# Altium project H.PrjPCB
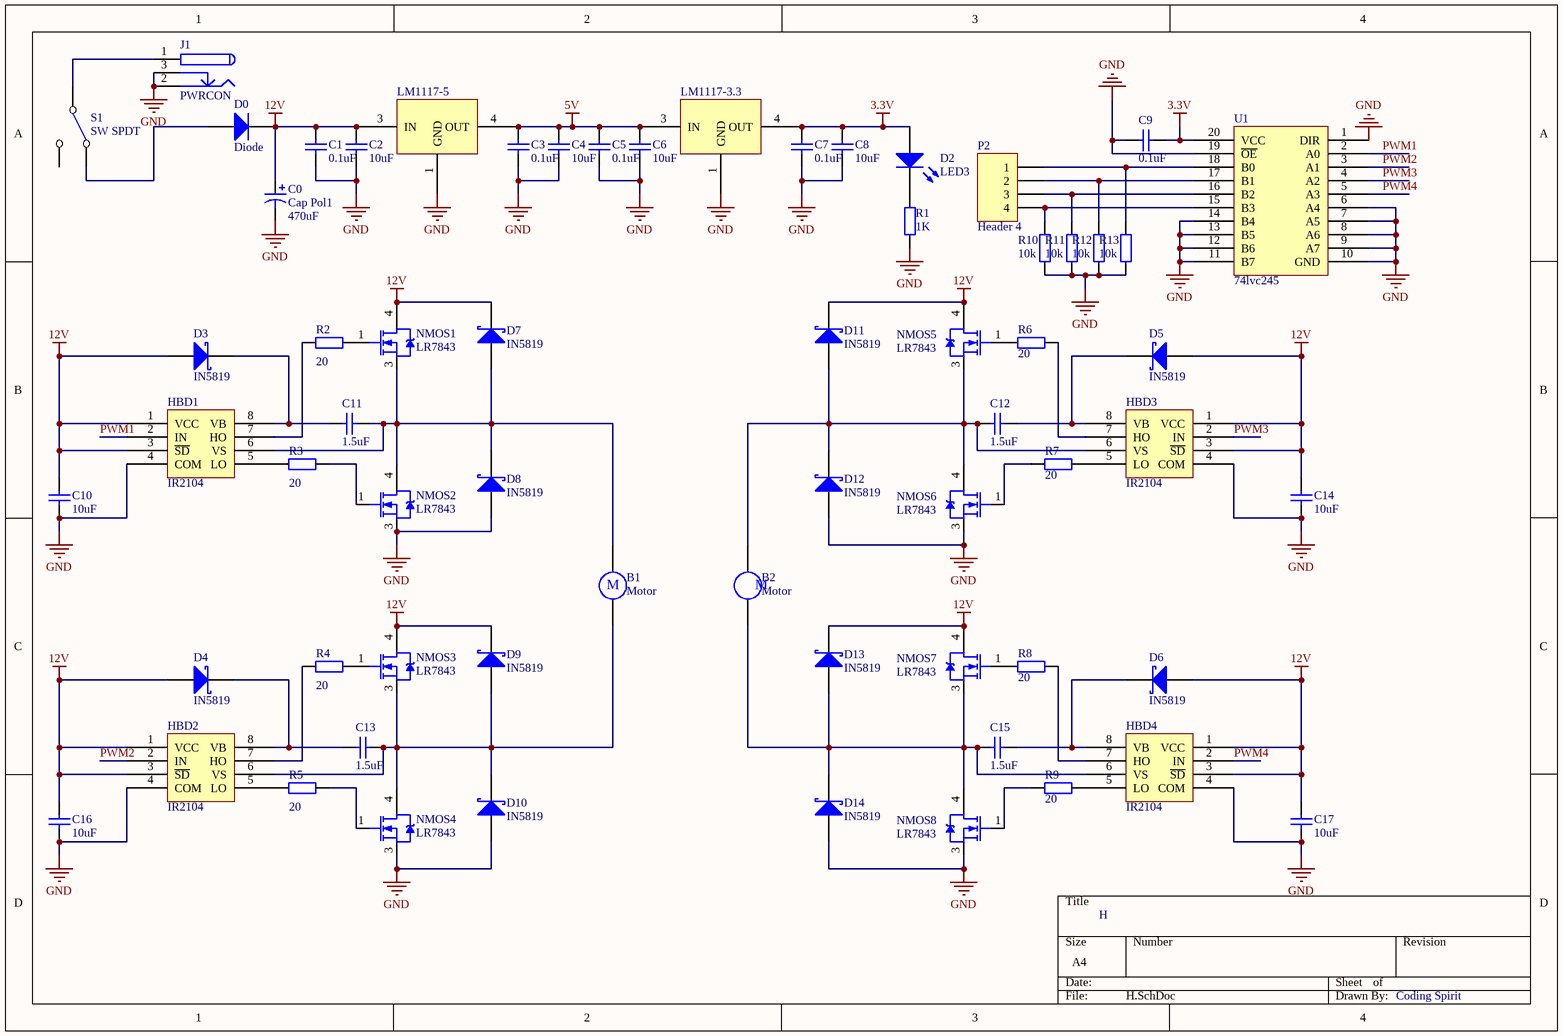
[diagram p0: H.SchDoc]
1 sheet, 65 parts. Net scope: global (net labels, ports and power ports of the same name join across sheets).
Board file: H.PcbDoc

## Sheet H.SchDoc: H
size A4; Date: 2016/8/7; Author: Coding Spirit; CompanyName: OUC; DrawnBy: Coding Spirit; Engineer: Coding Spirit

### Parts
B1  Motor  [5_08]
B2  Motor  [5_08]
C0  Cap Pol1  value 470uF  [C-RB-SD10]
C1  value 0.1uF  [C-0603]  (hidden comment: Cap)
C2  value 10uF  [C-0603]  (hidden comment: Cap)
C3  value 0.1uF  [C-0603]  (hidden comment: Cap)
C4  value 10uF  [C-0603]  (hidden comment: Cap)
C5  value 0.1uF  [C-0603]  (hidden comment: Cap)
C6  value 10uF  [C-0603]  (hidden comment: Cap)
C7  value 0.1uF  [C-0603]  (hidden comment: Cap)
C8  value 10uF  [C-0603]  (hidden comment: Cap)
C9  value 0.1uF  [C-0603]  (hidden comment: Cap)
C10  value 10uF  [C-0603]  (hidden comment: Cap)
C11  value 1.5uF  [C-0603]  (hidden comment: Cap)
C12  value 1.5uF  [C-0603]  (hidden comment: Cap)
C13  value 1.5uF  [C-0603]  (hidden comment: Cap)
C14  value 10uF  [C-0603]  (hidden comment: Cap)
C15  value 1.5uF  [C-0603]  (hidden comment: Cap)
C16  value 10uF  [C-0603]  (hidden comment: Cap)
C17  value 10uF  [C-0603]  (hidden comment: Cap)
D0  Diode  [SMA]
D2  LED3  [DSO-C2/D5.6]
D3  IN5819  [SMB-D]
D4  IN5819  [SMB-D]
D5  IN5819  [SMB-D]
D6  IN5819  [SMB-D]
D7  IN5819  [SMB-D]
D8  IN5819  [SMB-D]
D9  IN5819  [SMB-D]
D10  IN5819  [SMB-D]
D11  IN5819  [SMB-D]
D12  IN5819  [SMB-D]
D13  IN5819  [SMB-D]
D14  IN5819  [SMB-D]
HBD1  IR2104  [IR2104]
HBD2  IR2104  [IR2104]
HBD3  IR2104  [IR2104]
HBD4  IR2104  [IR2104]
J1  PWRCON  [DC-005]
LM1117-3.3  LM1117  [lm1117]  (value not drawn)
LM1117-5  LM1117  [lm1117]  (value not drawn)
NMOS1  LR7843  [IR7843]
NMOS2  LR7843  [IR7843]
NMOS3  LR7843  [IR7843]
NMOS4  LR7843  [IR7843]
NMOS5  LR7843  [IR7843]
NMOS6  LR7843  [IR7843]
NMOS7  LR7843  [IR7843]
NMOS8  LR7843  [IR7843]
P2  Header 4  [HDR1X4]
R1  value 1K  [0603-1]  (hidden comment: Res2)
R2  value 20  [0603-1]  (hidden comment: Res2)
R3  value 20  [0603-1]  (hidden comment: Res2)
R4  value 20  [0603-1]  (hidden comment: Res2)
R5  value 20  [0603-1]  (hidden comment: Res2)
R6  value 20  [0603-1]  (hidden comment: Res2)
R7  value 20  [0603-1]  (hidden comment: Res2)
R8  value 20  [0603-1]  (hidden comment: Res2)
R9  value 20  [0603-1]  (hidden comment: Res2)
R10  value 10k  [0603-1]  (hidden comment: Res2)
R11  value 10k  [0603-1]  (hidden comment: Res2)
R12  value 10k  [0603-1]  (hidden comment: Res2)
R13  value 10k  [0603-1]  (hidden comment: Res2)
S1  SW SPDT  [SW3P]
U1  74lvc245  [TSSOP-20]

### Nets
3.3V: C7.2 C8.2 C9.1 D2.1(A) LM1117-3.3.4(OUT) U1.20(VCC)
5V: C3.2 C4.2 C5.2 C6.2 LM1117-3.3.3(IN) LM1117-5.4(OUT)
12V: C0.1 C1.2 C2.2 C10.1 C14.1 C16.1 C17.1 D0.2(K) D3.1(A) D4.1(A) D5.1(A) D6.1(A) D7.2(K) D9.2(K) D11.2(K) D13.2(K) HBD1.1(VCC) HBD1.3(~{SD}) HBD2.1(VCC) HBD2.3(~{SD}) HBD3.1(VCC) HBD3.3(~{SD}) HBD4.1(VCC) HBD4.3(~{SD}) LM1117-5.3(IN) NMOS1.4(D) NMOS3.4(D) NMOS5.4(D) NMOS7.4(D)
GND: C0.2 C1.1 C2.1 C3.1 C4.1 C5.1 C6.1 C7.1 C8.1 C9.2 C10.2 C14.2 C16.2 C17.2 D8.1(A) D10.1(A) D12.1(A) D14.1(A) HBD1.4(COM) HBD2.4(COM) HBD3.4(COM) HBD4.4(COM) J1.2 J1.3 LM1117-3.3.1(GND) LM1117-5.1(GND) NMOS2.3(S) NMOS4.3(S) NMOS6.3(S) NMOS8.3(S) R1.1 R10.2 R11.2 R12.2 R13.2 U1.1(DIR) U1.6(A4) U1.7(A5) U1.8(A6) U1.9(A7) U1.10(GND) U1.11(B7) U1.12(B6) U1.13(B5) U1.14(B4) U1.19(~{OE})
PWM1: HBD1.2(IN) U1.2(A0)
PWM2: HBD2.2(IN) U1.3(A1)
PWM3: HBD3.2(IN) U1.4(A2)
PWM4: HBD4.2(IN) U1.5(A3)
NetB1_1: B1.1 C11.2 D7.1(A) D8.2(K) HBD1.6(VS) NMOS1.3(S) NMOS2.4(D)
NetB1_2: B1.2 C13.2 D9.1(A) D10.2(K) HBD2.6(VS) NMOS3.3(S) NMOS4.4(D)
NetB2_1: B2.1 C12.2 D11.1(A) D12.2(K) HBD3.6(VS) NMOS5.3(S) NMOS6.4(D)
NetB2_2: B2.2 C15.2 D13.1(A) D14.2(K) HBD4.6(VS) NMOS7.3(S) NMOS8.4(D)
NetC11_1: C11.1 D3.2(K) HBD1.8(VB)
NetC12_1: C12.1 D5.2(K) HBD3.8(VB)
NetC13_1: C13.1 D4.2(K) HBD2.8(VB)
NetC15_1: C15.1 D6.2(K) HBD4.8(VB)
NetD0_1: D0.1(A) S1.2(NC)
NetD2_2: D2.2(K) R1.2
NetHBD1_5: HBD1.5(LO) R3.1
NetHBD1_7: HBD1.7(HO) R2.1
NetHBD2_5: HBD2.5(LO) R5.1
NetHBD2_7: HBD2.7(HO) R4.1
NetHBD3_5: HBD3.5(LO) R7.1
NetHBD3_7: HBD3.7(HO) R6.1
NetHBD4_5: HBD4.5(LO) R9.1
NetHBD4_7: HBD4.7(HO) R8.1
NetJ1_1: J1.1 S1.1(COMMON)
NetNMOS1_1: NMOS1.1(G) R2.2
NetNMOS2_1: NMOS2.1(G) R3.2
NetNMOS3_1: NMOS3.1(G) R4.2
NetNMOS4_1: NMOS4.1(G) R5.2
NetNMOS5_1: NMOS5.1(G) R6.2
NetNMOS6_1: NMOS6.1(G) R7.2
NetNMOS7_1: NMOS7.1(G) R8.2
NetNMOS8_1: NMOS8.1(G) R9.2
NetP2_1: P2.1 R13.1 U1.18(B0)
NetP2_2: P2.2 R12.1 U1.17(B1)
NetP2_3: P2.3 R11.1 U1.16(B2)
NetP2_4: P2.4 R10.1 U1.15(B3)

Not connected (* = marked no-connect by the designer): S1 3(NO)

### Notes on the sheet
- (in symbol Motor) M

### Library data of the parts
B1 B2 = Motor: Motor, General Kind; Published: 24-Mar-1999; LatestRevisionDate: 17-Jul-2002; LatestRevisionNote: Re-released for DXP Platform.; PackageReference: RB5-10.5; Publisher: Altium Limited
C0 = Cap Pol1: Polarized Capacitor (Radial); Published: 8-Jun-2000; LatestRevisionDate: 17-Jul-2002; LatestRevisionNote: Re-released for DXP Platform.; PackageReference: RB7.6-15; Publisher: Altium Limited; PackageDescription: Polarized Capacitor (Radial); 2 Leads
C1-C17 = Cap Semi: Capacitor (Semiconductor SIM Model); Published: 8-Jun-2000; LatestRevisionDate: 29-May-2009; LatestRevisionNote: IPC-7351 Footprint Added.; PackageReference: C1206; Publisher: Altium Limited; PackageDescription: Chip Capacitor
D0 = Diode: Default Diode; Published: 8-Jun-2000; LatestRevisionDate: 17-Jul-2002; LatestRevisionNote: Re-released for DXP Platform.; PackageVersion: Sep-1996; PackageReference: SMC; Publisher: Altium Limited; PackageDescription: DO-214-AB/SMC; 2 C-Bend Leads; Body 7.9 x 5.9 mm, inc. leads (LxW); Code_JEDEC: DO-214-AB
D2 = LED3: Typical BLUE SiC LED; Published: 8-Jun-2000; LatestRevisionDate: 17-Dec-2003; LatestRevisionNote: PCB Footprint replaced.; DatasheetVersion: 16-Apr-2002; PackageVersion: 16-Apr-2002; PackageReference: 3.5X2.8X1.9; Publisher: Altium Limited
D3-D14 = D Schottky: Schottky Diode; Published: 8-Jun-2000; LatestRevisionDate: 17-Jul-2002; LatestRevisionNote: Re-released for DXP Platform.; PackageReference: SMB; Publisher: Altium Limited; PackageDescription: DO-214-AA/SMB; 2 C-Bend Leads; Body 5.3 x 3.6 mm, inc. leads (LxW); Code_JEDEC: DO-214-AA
J1 = PWRCON: 直流电源端子; Published: 17-Dec-2003; DatasheetDocument: 09-May-2002; Publisher: Altium Limited; ComponentLink1Description: Manufacturer Link; ComponentLink1URL: http://domino.kycon.com/internet/Products.html
NMOS1-NMOS8 = IR7843
P2 = Header 4: Header, 4-Pin; LatestRevisionDate: 17-Jul-2002; LatestRevisionNote: Re-released for DXP Platform.; Publisher: Altium Limited
R1-R13 = Res2: Resistor; Published: 8-Jun-2000; LatestRevisionDate: 17-Jul-2002; LatestRevisionNote: Re-released for DXP Platform.; PackageReference: AXIAL-0.4; Publisher: Altium Limited; PackageDescription: Axial Device, Thru-Hole; 2 Leads; 0.4 in Pin Spacing